# Altium schematic sheet ChangeLog.SchDoc
size A4; DocumentNumber: 2; SheetNumber: 2; SheetTotal: 2
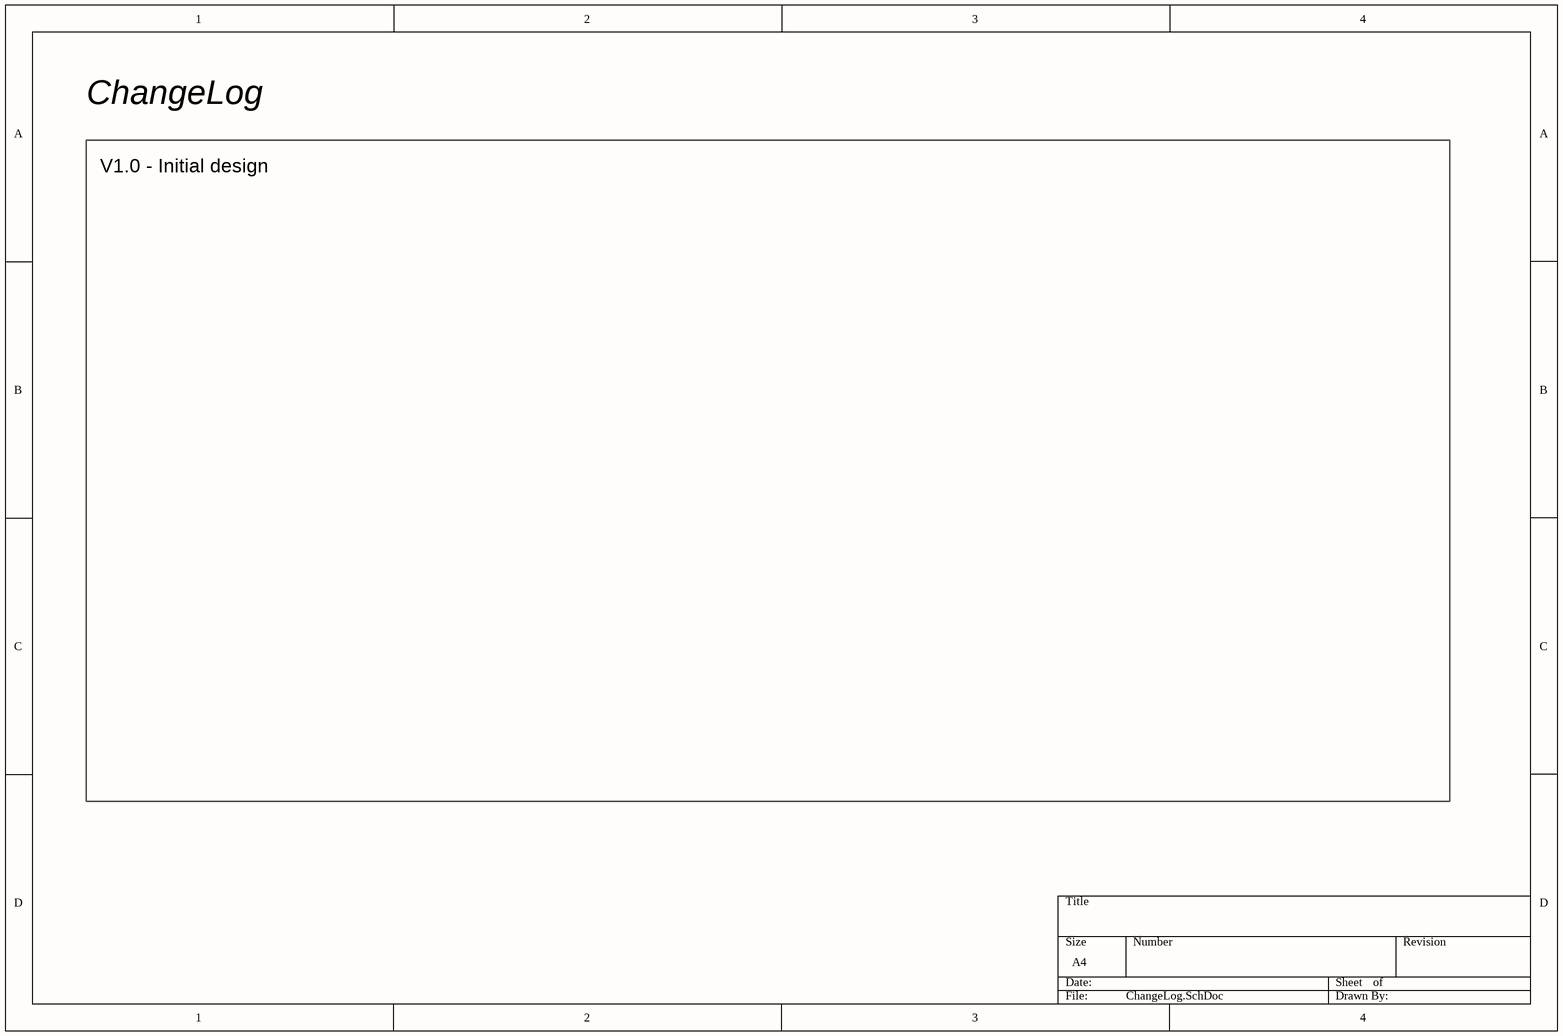
[diagram p0: ChangeLog.SchDoc]

## Notes on the sheet
- ChangeLog
- V1.0 - Initial design